# EAGLE schematic SectionB_Schematic (EAGLE 9.3.0)
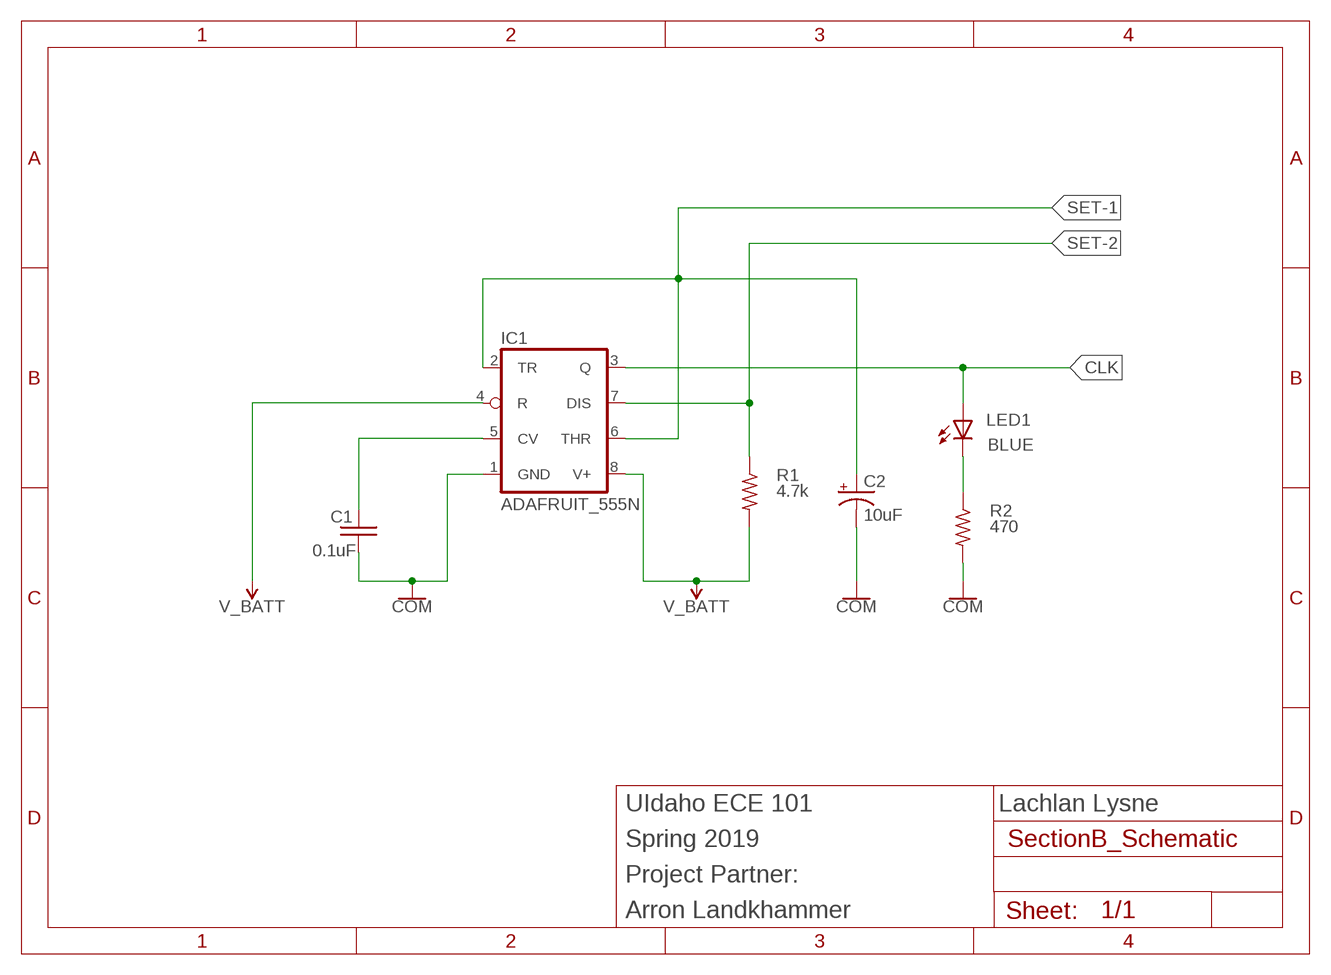
[diagram p0: schematic, sheet 1]

## Parts
C1  0.1uF  ADAFRUIT_C-US025-025X050  [ADAFRUIT_C025-025X050]
C2  10uF  ADAFRUIT_CPOL-USE2-5  [ADAFRUIT_E2-5]
IC1  ADAFRUIT_555N  [ADAFRUIT_DIL08-ROUND]
LED1  ADAFRUIT_LED5MM  [ADAFRUIT_LED5MM]
R1  4.7k  ADAFRUIT_R-US_0207/10  [ADAFRUIT_0207/10]
R2  470  ADAFRUIT_R-US_0207/10  [ADAFRUIT_0207/10]

## Nets
CLK: IC1.3(Q) LED1.A
GND: C1.2 C2.- IC1.1(GND) R2.2 ; supply symbol labelled COM
N$2: LED1.K(C) R2.1
N$3: C1.1 IC1.5(CV)
SET-1: C2.+ IC1.2(TR) IC1.6(THR)
SET-2: IC1.7(DIS) R1.1
V_BATT: IC1.4(R) IC1.8(V+) R1.2

## Notes on the sheet
- UIdaho ECE 101 | Lachlan Lysne
- Spring 2019
- Project Partner:
- Arron Landkhammer

## Library data of the parts
C1 = SECTION B:ADAFRUIT_C-US: CAPACITOR, American symbol
C2 = SECTION B:ADAFRUIT_CPOL-US: POLARIZED CAPACITOR, American symbol
IC1 = SECTION B:ADAFRUIT_*555: TIMER Changed DIP package to have round (not oval) pin pads http://www.ladyada.net/library/pcb/eaglelibrary.html
LED1 = SECTION B:ADAFRUIT_LED: LED OSRAM: - CHIPLED LG R971, LG N971, LY N971, LG Q971, LY Q971, LO R971, LY R971 LH N974, LH R974 LS Q976, LO Q976, LY Q976 LO Q996 - Hyper CHIPLED LW Q18S LB Q993, LB Q99A, LB R99A - SideLED LS A670, LO A670, LY A670, LG A670, LP A670 LB A673, LV A673, LT A673, LW A673 LH A674 LY A675 LS A676, LA A676, LO A676, LY A676, LW A676 LS A679, LY A679, LG A679 - Hyper Micro SIDELED® LS Y876, LA Y876, LO Y876, LY Y876 LT Y87S - SmartLED LW L88C, LW L88S LB L89C, LB L89S, LG L890 LS L89K, LO L89K, LY L89K LS L896, LA L896, LO L896, LY L896 - TOPLED LS T670, LO T670, LY T670, LG T670, LP T670 LSG T670, LSP T670, LSY T670, LOP T670, LYG T670 LG T671, LOG T671, LSG T671 LB T673, LV T673, LT T673, LW T673 LH T674 LS T676, LA T676, LO T676, LY T676, LB T676, LH T676, LSB T676, LW T676 LB T67C, LV T67C, LT T67C, LS T67K, LO T67K, LY T67K, LW E67C LS E67B, LA E67B, LO E67B, LY E67B, LB E67C, LV E67C, LT E67C LW T67C LS T679, LY T679, LG T679 LS T770, LO T770, LY T770, LG T770, LP T770 LB T773, LV T773, LT T773, LW T773 LH T774 LS E675, LA E675, LY E675, LS T675 LS T776, LA T776, LO T776, LY T776, LB T776 LHGB T686 LT T68C, LB T68C - Hyper Mini TOPLED® LB M676 - Mini TOPLED Santana® LG M470 LS M47K, LO M47K, LY M47K Source: http://www.osram.convergy.de/; COLOR: BLUE
R1 R2 = SECTION B:ADAFRUIT_R-US_: RESISTOR, American symbol